# EAGLE design beagletone_jamsession_v0001a (EAGLE 6.4)

## Sheet 1 of 5: BBB Outline
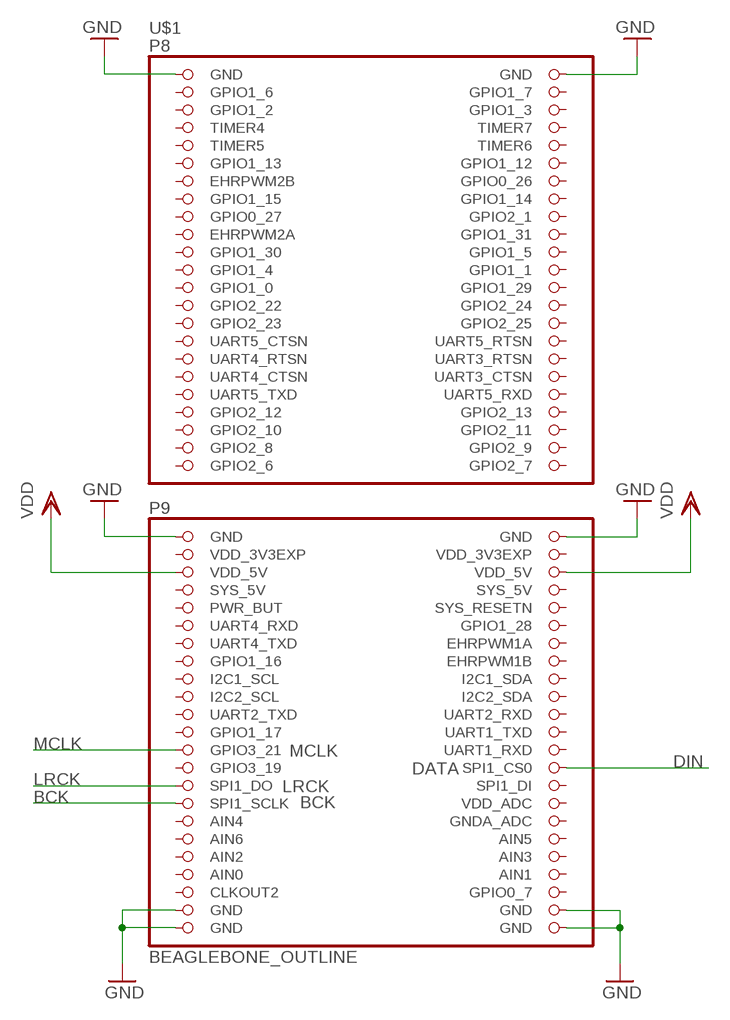
[diagram p0: schematic, sheet 1]

### Parts
U$1  BEAGLEBONE_OUTLINE  [BEAGLEBONE_SHIELD]

### Nets
BCK: U$1.77(SPI1_SCLK) ; also sheet 2
DIN: U$1.74(SPI1_CS0) ; also sheet 2
GND: U$1.1(GND) U$1.2(GND) U$1.47(GND) U$1.48(GND) U$1.89(GND) U$1.90(GND) U$1.91(GND) U$1.92(GND) ; also sheet 2,3,4,5
LRCK: U$1.75(SPI1_DO) ; also sheet 2
MCLK: U$1.71(GPIO3_21)
VDD: U$1.51(VDD_5V) U$1.52(VDD_5V) ; also sheet 2,4,5
Unconnected: U$1.3(GPIO1_6) U$1.4(GPIO1_7) U$1.5(GPIO1_2) U$1.6(GPIO1_3) U$1.7(TIMER4) U$1.8(TIMER7) U$1.9(TIMER5) U$1.10(TIMER6) U$1.11(GPIO1_13) U$1.12(GPIO1_12) U$1.13(EHRPWM2B) U$1.14(GPIO0_26) U$1.15(GPIO1_15) U$1.16(GPIO1_14) U$1.17(GPIO0_27) U$1.18(GPIO2_1) U$1.19(EHRPWM2A) U$1.20(GPIO1_31) U$1.21(GPIO1_30) U$1.22(GPIO1_5) U$1.23(GPIO1_4) U$1.24(GPIO1_1) U$1.25(GPIO1_0) U$1.26(GPIO1_29) U$1.27(GPIO2_22) U$1.28(GPIO2_24) U$1.29(GPIO2_23) U$1.30(GPIO2_25) U$1.31(UART5_CTSN) U$1.32(UART5_RTSN) U$1.33(UART4_RTSN) U$1.34(UART3_RTSN) U$1.35(UART4_CTSN) U$1.36(UART3_CTSN) U$1.37(UART5_TXD) U$1.38(UART5_RXD) U$1.39(GPIO2_12) U$1.40(GPIO2_13) U$1.41(GPIO2_10) U$1.42(GPIO2_11) U$1.43(GPIO2_8) U$1.44(GPIO2_9) U$1.45(GPIO2_6) U$1.46(GPIO2_7) U$1.54(SYS_5V) U$1.55(PWR_BUT) U$1.56(SYS_RESETN) U$1.57(UART4_RXD) U$1.58(GPIO1_28) U$1.59(UART4_TXD) U$1.60(EHRPWM1A) U$1.61(GPIO1_16) U$1.62(EHRPWM1B) U$1.63(I2C1_SCL) U$1.64(I2C1_SDA) U$1.65(I2C2_SCL) U$1.66(I2C2_SDA) U$1.67(UART2_TXD) U$1.68(UART2_RXD) U$1.69(GPIO1_17) U$1.70(UART1_TXD) U$1.72(UART1_RXD) U$1.73(GPIO3_19) U$1.76(SPI1_DI) U$1.78(VDD_ADC) U$1.79(AIN4) U$1.80(GNDA_ADC) U$1.81(AIN6) U$1.82(AIN5) U$1.83(AIN2) U$1.84(AIN3) U$1.86(AIN1) U$1.87(CLKOUT2) U$1.88(GPIO0_7)

### Notes on the sheet
- MCLK
- DATA
- LRCK
- BCK

## Sheet 2 of 5: DAC
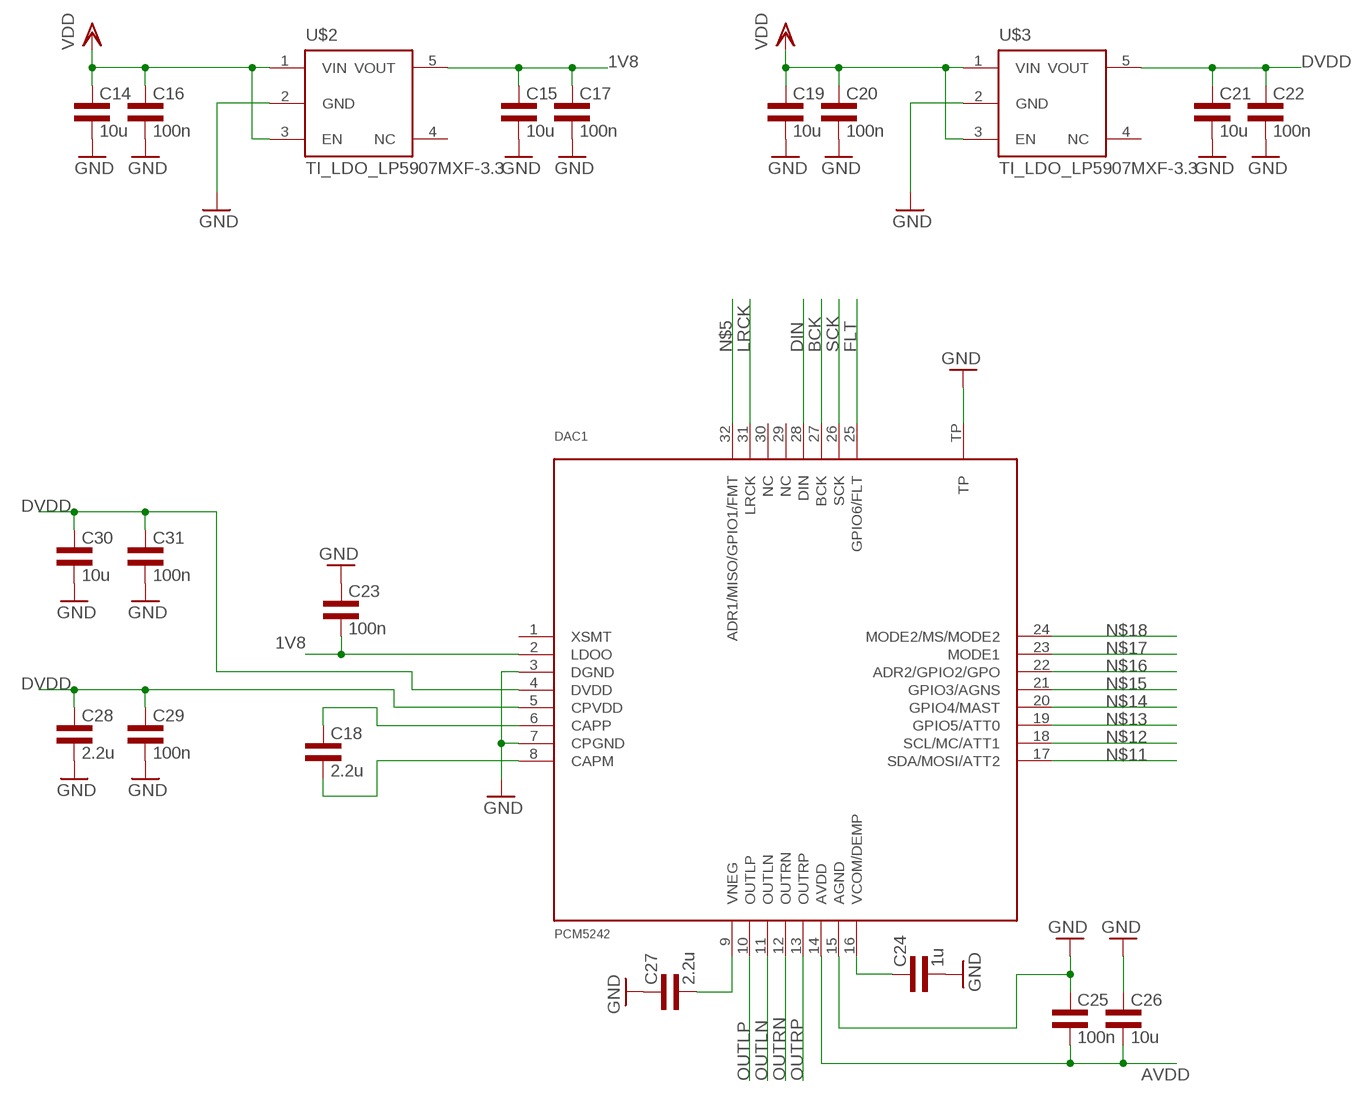
[diagram p1: schematic, sheet 2]

### Parts
C14  10u  CAP0805L3  [0805L3]
C15  10u  CAP0805L3  [0805L3]
C16  100n  CAP0603L3  [0603L3]
C17  100n  CAP0603L3  [0603L3]
C18  2.2u  CAP0805L3  [0805L3]
C19  10u  CAP0805L3  [0805L3]
C20  100n  CAP0603L3  [0603L3]
C21  10u  CAP0805L3  [0805L3]
C22  100n  CAP0603L3  [0603L3]
C23  100n  CAP0402L3  [0402L3]
C24  1u  CAP0603L3  [0603L3]
C25  100n  CAP0402L3  [0402L3]
C26  10u  CAP0603L3  [0603L3]
C27  2.2u  CAP0805L3  [0805L3]
C28  2.2u  CAP0805L3  [0805L3]
C29  100n  CAP0402L3  [0402L3]
C30  10u  CAP0603L3  [0603L3]
C31  100n  CAP0402L3  [0402L3]
DAC1  PCM5242  [S-PVQFN-N32]
U$2  TI_LDO_LP5907MXF-3.3  [TI_LDO_SOT-23]
U$3  TI_LDO_LP5907MXF-3.3  [TI_LDO_SOT-23]

### Nets
1V8: C15.1 C17.P$1 C23.P$2 DAC1.2(LDOO) U$2.5(VOUT)
AVDD: C25.P$2 C26.P$2 DAC1.14(AVDD) ; also sheet 5
BCK: DAC1.27(BCK) ; also sheet 1
DIN: DAC1.28(DIN) ; also sheet 1
DVDD: C21.1 C22.P$1 C28.1 C29.P$1 C30.P$1 C31.P$1 DAC1.4(DVDD) DAC1.5(CPVDD) U$3.5(VOUT)
FLT: DAC1.25(GPIO6/FLT)
GND: C14.2 C15.2 C16.P$2 C17.P$2 C19.2 C20.P$2 C21.2 C22.P$2 C23.P$1 C24.P$2 C25.P$1 C26.P$1 C27.1 C28.2 C29.P$2 C30.P$2 C31.P$2 DAC1.3(DGND) DAC1.7(CPGND) DAC1.15(AGND) DAC1.TP U$2.2(GND) U$3.2(GND) ; also sheet 1,3,4,5
LRCK: DAC1.31(LRCK) ; also sheet 1
N$5: DAC1.32(ADR1/MISO/GPIO1/FMT)
N$11: DAC1.17(SDA/MOSI/ATT2)
N$12: DAC1.18(SCL/MC/ATT1)
N$13: DAC1.19(GPIO5/ATT0)
N$14: DAC1.20(GPIO4/MAST)
N$15: DAC1.21(GPIO3/AGNS)
N$16: DAC1.22(ADR2/GPIO2/GPO)
N$17: DAC1.23(MODE1)
N$18: DAC1.24(MODE2/MS/MODE2)
N$22: C18.1 DAC1.6(CAPP)
N$23: C18.2 DAC1.8(CAPM)
N$26: C24.P$1 DAC1.16(VCOM/DEMP)
N$29: C27.2 DAC1.9(VNEG)
OUTLN: DAC1.11(OUTLN) ; also sheet 3
OUTLP: DAC1.10(OUTLP) ; also sheet 3
OUTRN: DAC1.12(OUTRN) ; also sheet 3
OUTRP: DAC1.13(OUTRP) ; also sheet 3
SCK: DAC1.26(SCK)
VDD: C14.1 C16.P$1 C19.1 C20.P$1 U$2.1(VIN) U$2.3(EN) U$3.1(VIN) U$3.3(EN) ; also sheet 1,4,5
Unconnected: DAC1.1(XSMT) DAC1.29(NC) DAC1.30(NC) U$2.4(NC) U$3.4(NC)

## Sheet 3 of 5: HP OUT
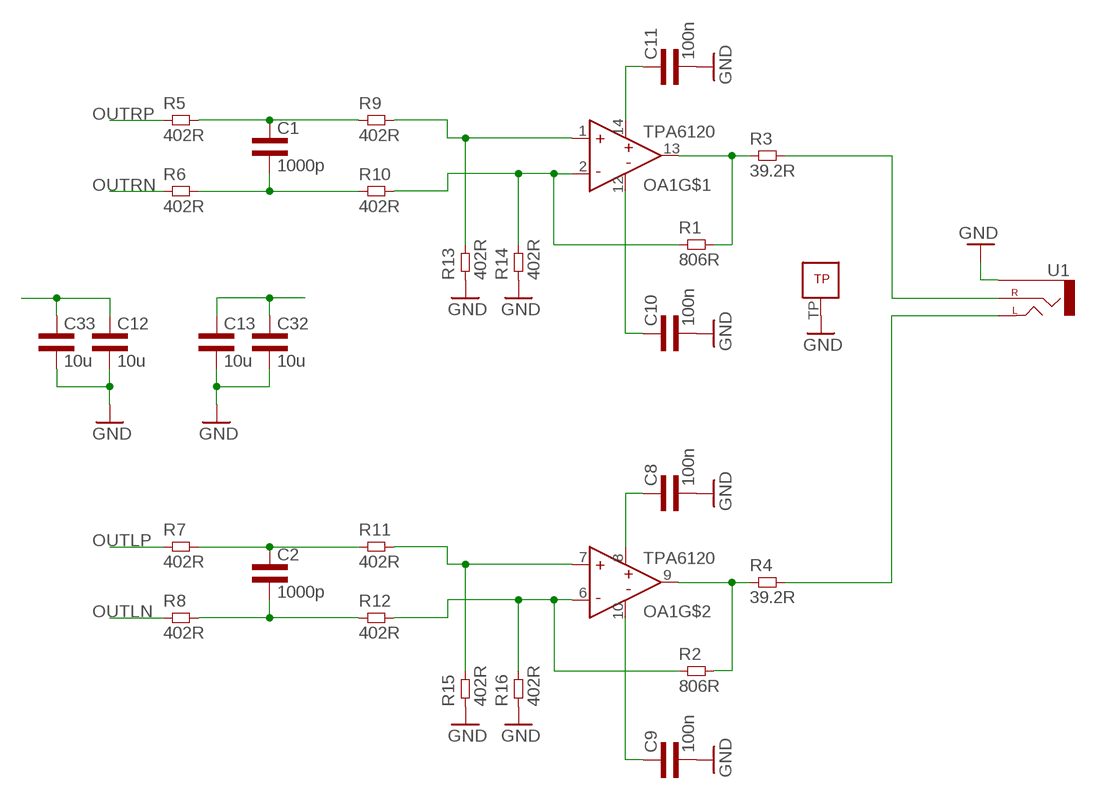
[diagram p2: schematic, sheet 3]

### Parts
C1  1000p  CAP0603L3  [0603L3]
C2  1000p  CAP0603L3  [0603L3]
C8  100n  CAP0603L3  [0603L3]
C9  100n  CAP0603L3  [0603L3]
C10  100n  CAP0603L3  [0603L3]
C11  100n  CAP0603L3  [0603L3]
C12  10u  CAP0603L3  [0603L3]
C13  10u  CAP0603L3  [0603L3]
C32  10u  CAP0603L3  [0603L3]
C33  10u  CAP0603L3  [0603L3]
OA1  TPA6120QFN  [S-PVQFN-N14]
R1  806R  RES0603L3  [0603L3]
R2  806R  RES0603L3  [0603L3]
R3  39.2R  RES0805L3  [0805L3]
R4  39.2R  RES0805L3  [0805L3]
R5  402R  RES0603L3  [0603L3]
R6  402R  RES0603L3  [0603L3]
R7  402R  RES0603L3  [0603L3]
R8  402R  RES0603L3  [0603L3]
R9  402R  RES0603L3  [0603L3]
R10  402R  RES0603L3  [0603L3]
R11  402R  RES0603L3  [0603L3]
R12  402R  RES0603L3  [0603L3]
R13  402R  RES0603L3  [0603L3]
R14  402R  RES0603L3  [0603L3]
R15  402R  RES0603L3  [0603L3]
R16  402R  RES0603L3  [0603L3]
U1  AUDIO-JACKSMD2  [AUDIO-JACK-3.5MM-SMD]

### Nets
GND: C8.P$2 C9.P$2 C10.P$2 C11.P$2 C12.P$2 C13.P$2 C32.P$2 C33.P$2 OA1.TP R13.P$1 R14.P$1 R15.P$1 R16.P$1 U1.SLEEVE ; also sheet 1,2,4,5
N$1: OA1.13(OUT) R1.P$2 R3.1
N$2: OA1.2(IN-) R1.P$1 R10.P$2 R14.P$2
N$3: OA1.9(OUT) R2.P$2 R4.1
N$4: OA1.6(IN-) R2.P$1 R12.P$2 R16.P$2
N$6: OA1.7(IN+) R11.P$2 R15.P$2
N$7: C2.P$2 R8.P$2 R12.P$1
N$8: C2.P$1 R7.P$2 R11.P$1
N$9: OA1.1(IN+) R9.P$2 R13.P$2
N$10: C1.P$1 R5.P$2 R9.P$1
N$19: C1.P$2 R6.P$2 R10.P$1
N$20: R3.2 U1.RING(RIGHT)
N$21: R4.2 U1.TIP(LEFT)
OUTLN: R8.P$1 ; also sheet 2
OUTLP: R7.P$1 ; also sheet 2
OUTRN: R6.P$1 ; also sheet 2
OUTRP: R5.P$1 ; also sheet 2
VCC+: C8.P$1 C11.P$1 C12.P$1 C33.P$1 OA1.8(V+) OA1.14(V+) ; also sheet 4
VCC-: C9.P$1 C10.P$1 C13.P$1 C32.P$1 OA1.10(V-) OA1.12(V-) ; also sheet 4

## Sheet 4 of 5: +5V / -5V
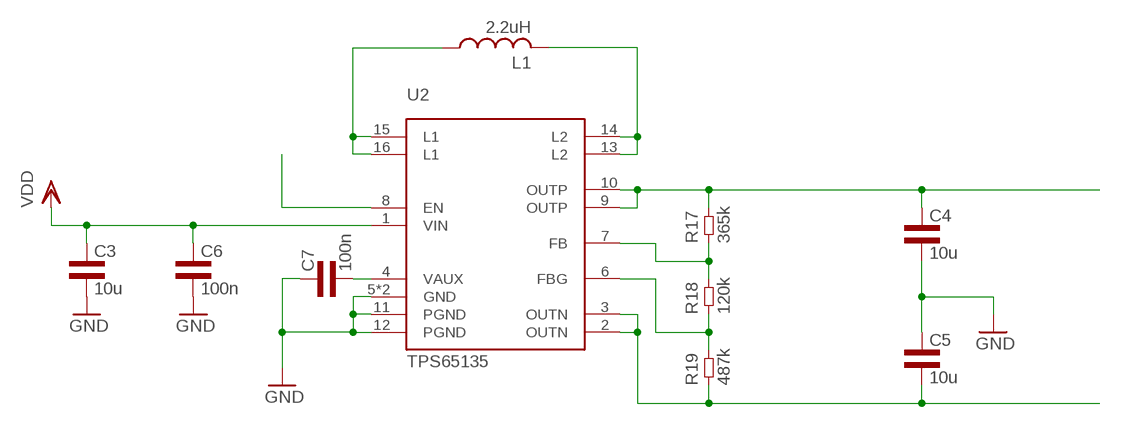
[diagram p3: schematic, sheet 4]

### Parts
C3  10u  CAP0805L3  [0805L3]
C4  10u  CAP0805L3  [0805L3]
C5  10u  CAP0805L3  [0805L3]
C6  100n  CAP0603L3  [0603L3]
C7  100n  CAP0603L3  [0603L3]
L1  2.2uH  L-USL3  [2520]
R17  365k  RES0805L3  [0805L3]
R18  120k  RES0805L3  [0805L3]
R19  487k  RES0805L3  [0805L3]
U2  TPS65135  [S-PWQFN-N16_RTE]

### Nets
EN: U2.8(EN)
FB: R17.1 R18.2 U2.7(FB)
FBG: R18.1 R19.2 U2.6(FBG)
GND: C3.2 C4.2 C5.1 C6.P$2 C7.P$1 U2.5(GND) U2.11(PGND) U2.12(PGND) U2.P$1(GND) ; also sheet 1,2,3,5
L1: L1.1 U2.15(L1) U2.16(L1)
L2: L1.2 U2.13(L2) U2.14(L2)
VAUX: C7.P$2 U2.4(VAUX)
VCC+: C4.1 R17.2 U2.9(OUTP) U2.10(OUTP) ; also sheet 3
VCC-: C5.2 R19.1 U2.2(OUTN) U2.3(OUTN) ; also sheet 3
VDD: C3.1 C6.P$1 U2.1(VIN) ; also sheet 1,2,5

## Sheet 5 of 5: AVDD
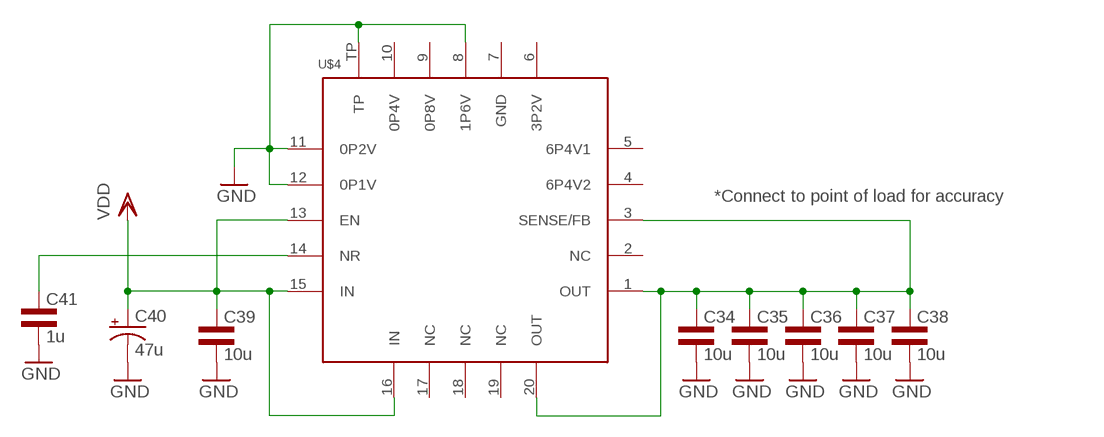
[diagram p4: schematic, sheet 5]

### Parts
C34  10u  CAP0603L3  [0603L3]
C35  10u  CAP0603L3  [0603L3]
C36  10u  CAP0603L3  [0603L3]
C37  10u  CAP0603L3  [0603L3]
C38  10u  CAP0603L3  [0603L3]
C39  10u  CAP0603L3  [0603L3]
C40  47u  CPOL-USCT3216  [CT3216]
C41  1u  CAP0603L3  [0603L3]
U$4  POWER-SUPPLY_POS_V1_TI_LDO_TPS7A4700  [POWER-SUPPLY_POS_V1_TI_LDO_VQFN-20]

### Nets
AVDD: C34.P$1 C35.P$1 C36.P$1 C37.P$1 C38.P$1 U$4.1(OUT) U$4.3(SENSE/FB) U$4.20(OUT) ; also sheet 2
GND: C34.P$2 C35.P$2 C36.P$2 C37.P$2 C38.P$2 C39.P$2 C40.- C41.P$2 U$4.8(1P6V) U$4.11(0P2V) U$4.12(0P1V) U$4.TP ; also sheet 1,2,3,4
N$28: C41.P$1 U$4.14(NR)
VDD: C39.P$1 C40.+ U$4.13(EN) U$4.15(IN) U$4.16(IN) ; also sheet 1,2,4
Unconnected: U$4.2(NC) U$4.4(6P4V2) U$4.5(6P4V1) U$4.6(3P2V) U$4.7(GND) U$4.9(0P8V) U$4.10(0P4V) U$4.17(NC) U$4.18(NC) U$4.19(NC)

### Notes on the sheet
- *Connect to point of load for accuracy

## Power pins joined to a net without a drawn wire
AIN0: U$1.85(AIN0)
SYS_5V: U$1.53(SYS_5V)
VDD_3V3EXP: U$1.49(VDD_3V3EXP) U$1.50(VDD_3V3EXP)

## Library data of the parts
C1-C39 C41 = common:CAP
C40 = rcl:CPOL-US: POLARIZED CAPACITOR, American symbol
DAC1 = common:PCM5242
L1 = rcl:L-US: INDUCTOR, American symbol
OA1 = common:TPA6120
R1-R19 = common:RES
U1 = SparkFun-Connectors:AUDIO-JACK: 3.5mm Audio Jack Simple 3.5mm common PCB mount audio jack. SKU: PRT-08032
U2 = common:TPS65135
U$1 = adafruit:BEAGLEBONE_OUTLINE: Should match A3 pinout - but not completely tested
U$2 U$3 = pcm2707_v1:TI_LDO_LP5907MXF-3.3
U$4 = my_dac_amp:POWER-SUPPLY_POS_V1_TI_LDO_TPS7A4700

## Board
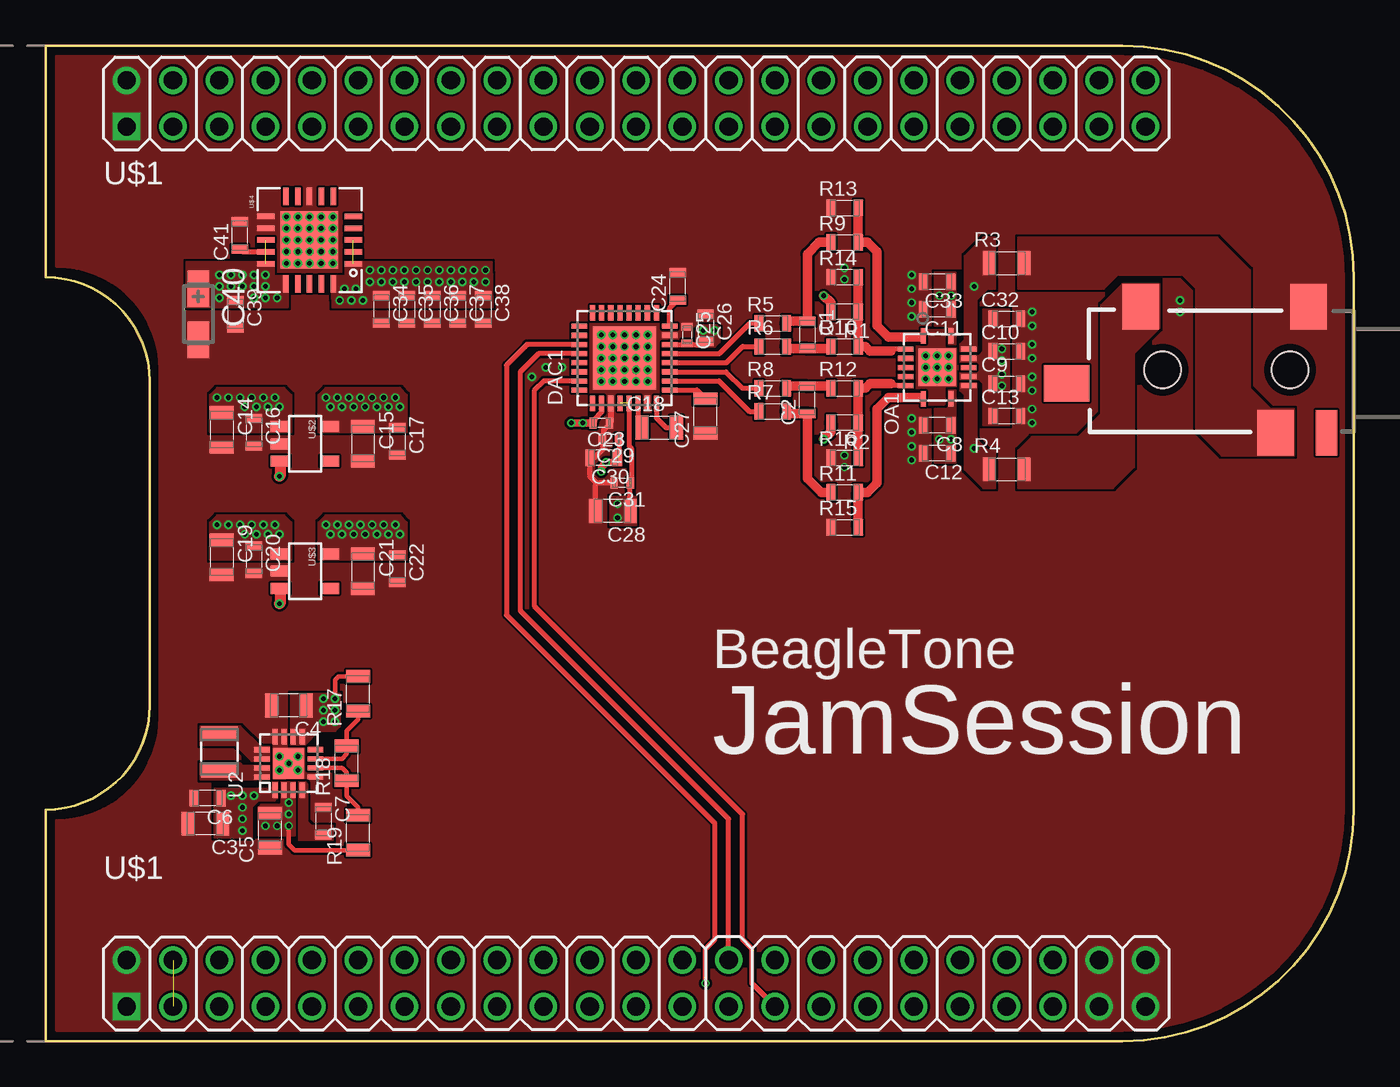
[diagram p5: board, top side]
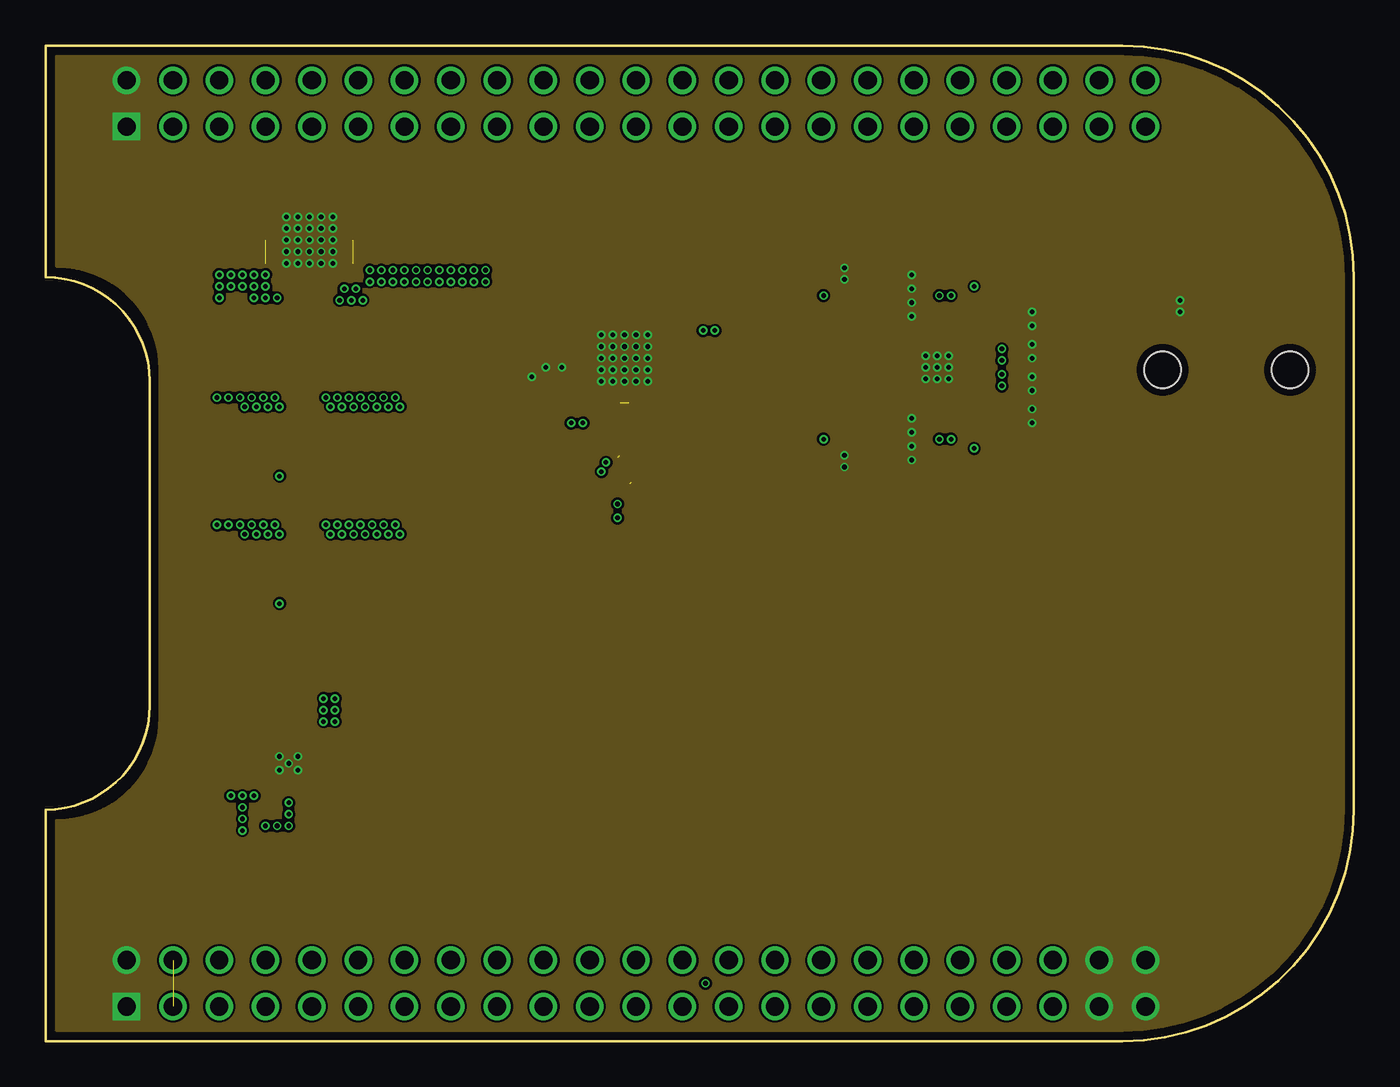
[diagram p6: board, inner layer Route2]
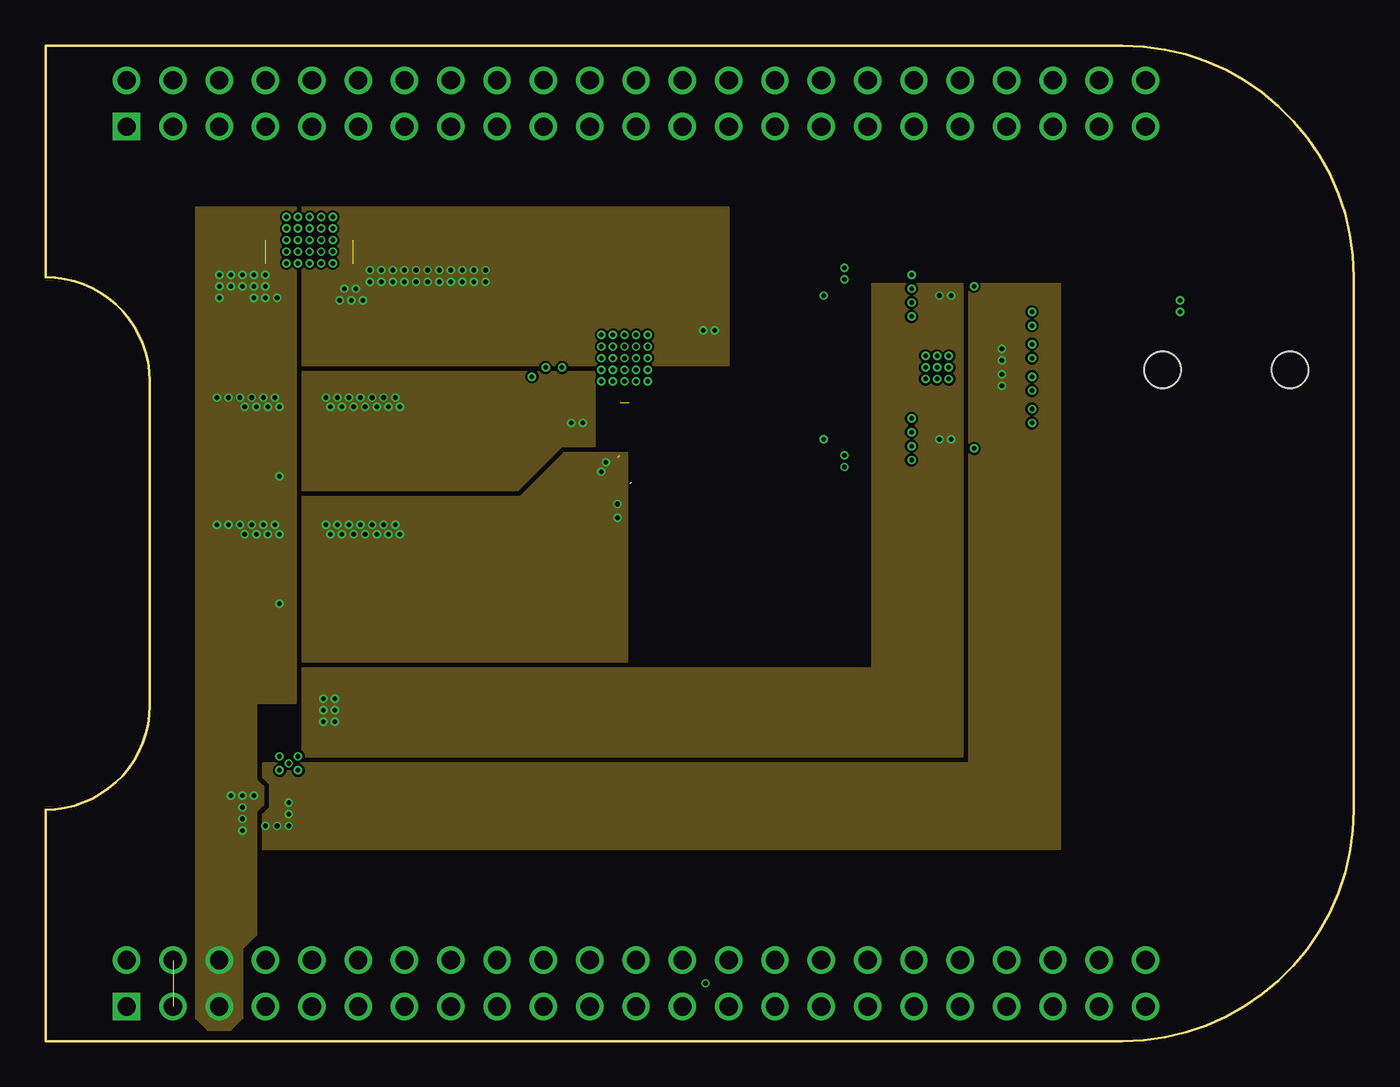
[diagram p7: board, inner layer Route3]
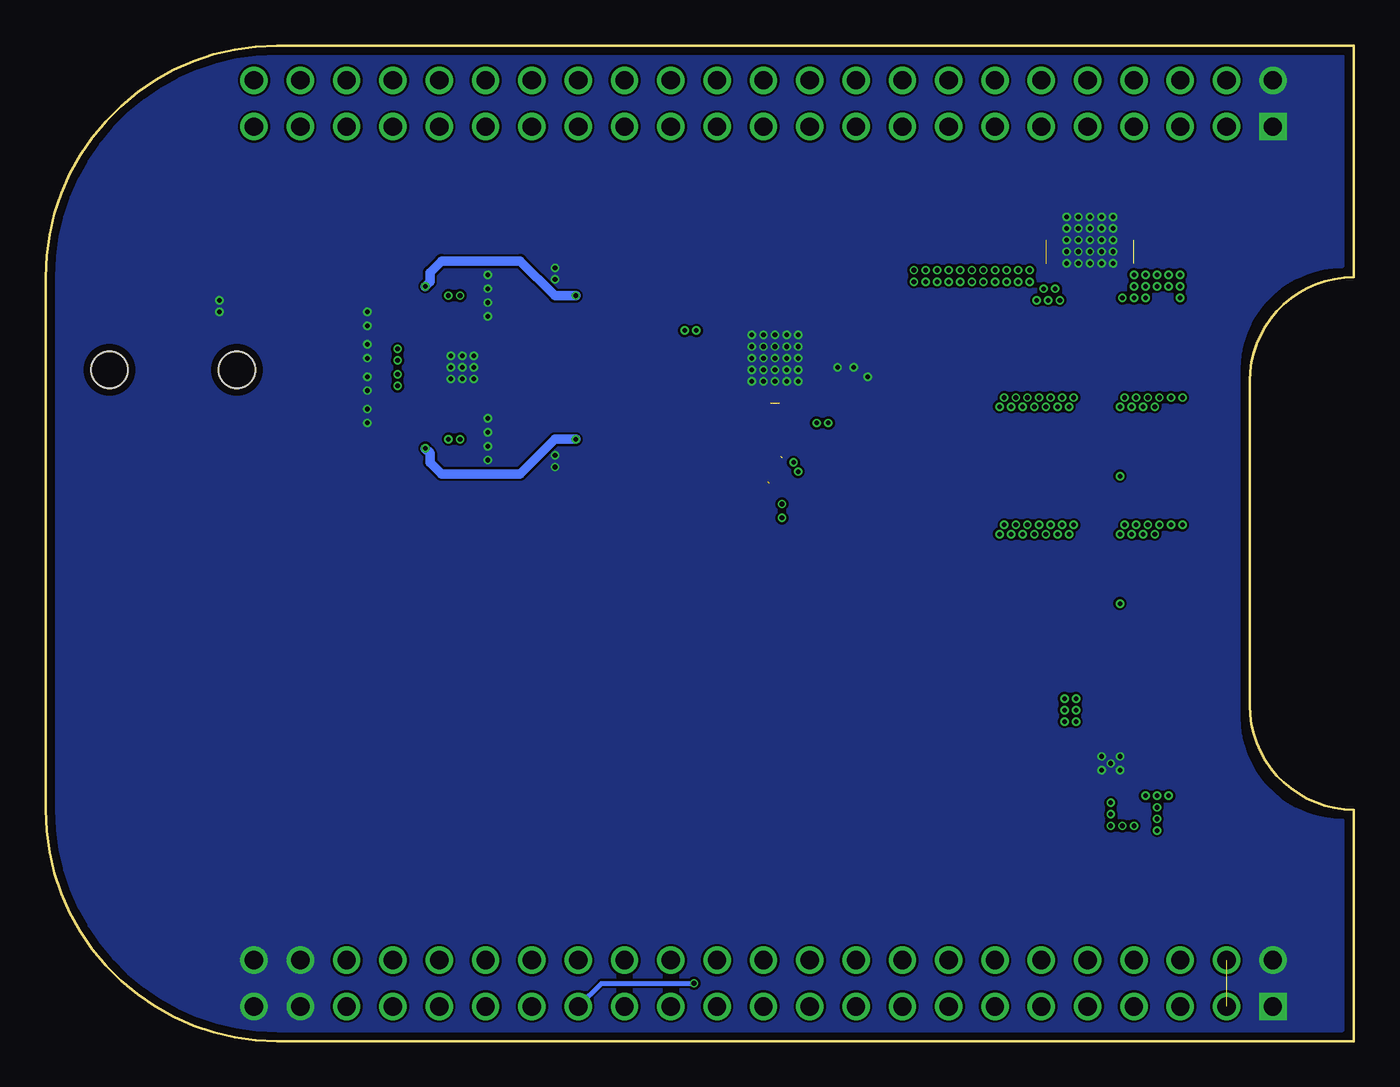
[diagram p8: board, bottom side, seen from below]

Size 71.75 x 54.61 mm. Coordinates in mm from the lower left corner, seen from the top.
Copper layers (1*2*3*16): Top 0.035mm / dielectric 1.5mm / Route2 0.035mm / dielectric 0.15mm / Route3 0.035mm / dielectric 0.2mm / Bottom 0.035mm
Design rules "default *": minimum track width 5mil, minimum drill 10mil, track to track 5mil, track to pad 5mil, pad to pad 5mil, via to via 5mil, smd to smd 5mil, copper to edge 16mil, drill to drill 5mil, minimum pad ring 4mil, minimum via ring 4mil, stop-mask expansion 4mil, vias tented up to drill 16mil, thermal gap 10mil

### Footprints (pad centres in the part's own frame; a part is rotated, then mirrored left to right if it is on the bottom)
0603L3 = smd 0.5 x 0.9: P$1 -0.75,0; P$2 0.75,0
0805L3 = smd 0.7 x 1.3: 1 -0.95,0; 2 0.95,0
0402L3 = smd 0.4 x 0.6: P$1 -0.45,0; P$2 0.45,0
CT3216 = smd 2 x 1.2: + -1.4,0; - 1.4,0
S-PVQFN-N32 = smd 0.85 x 0.28: 1 -2.475,1.75; 2 -2.475,1.25; 3 -2.475,0.75; 4 -2.475,0.25; 5 -2.475,-0.25; 6 -2.475,-0.75; 7 -2.475,-1.25; 8 -2.475,-1.75; 17 2.475,-1.75; 18 2.475,-1.25; 19 2.475,-0.75; 20 2.475,-0.25; 21 2.475,0.25; 22 2.475,0.75; 23 2.475,1.25; 24 2.475,1.75 | smd 0.28 x 0.85: 9 -1.75,-2.475; 10 -1.25,-2.475; 11 -0.75,-2.475; 12 -0.25,-2.475; 13 0.25,-2.475; 14 0.75,-2.475; 15 1.25,-2.475; 16 1.75,-2.475; 25 1.75,2.475; 26 1.25,2.475; 27 0.75,2.475; 28 0.25,2.475; 29 -0.25,2.475; 30 -0.75,2.475; 31 -1.25,2.475; 32 -1.75,2.475 | smd 3.45 x 3.45: TP 0,0
2520 = smd 0.8 x 2: 1 -1,0; 2 1,0
S-PVQFN-N14 = smd 0.85 x 0.28: 1 -1.725,-0.75; 7 1.725,-0.75; 8 1.725,0.75; 14 -1.725,0.75 | smd 0.28 x 0.85: 2 -1,-1.725; 3 -0.5,-1.725; 4 0,-1.725; 5 0.5,-1.725; 6 1,-1.725; 9 1,1.725; 10 0.5,1.725; 11 0,1.725; 12 -0.5,1.725; 13 -1,1.725 | smd 2.05 x 2.05: TP 0,0
AUDIO-JACK-3.5MM-SMD = smd 2 x 2.5: RING 4.3,3.45; SLEEVE 2.5,-3.45; TIP 11.7,-3.45 | smd 1.2 x 2.5: RSH 1.5,3.45 | smd 2.5 x 2: TSH 15.75,0.75 | hole 2: 3.5,0; 10.5,0
S-PWQFN-N16_RTE = smd 0.85 x 0.28: 1 -1.475,0.75; 2 -1.475,0.25; 3 -1.475,-0.25; 4 -1.475,-0.75; 9 1.475,-0.75; 10 1.475,-0.25; 11 1.475,0.25; 12 1.475,0.75 | smd 0.28 x 0.85: 5 -0.75,-1.475; 6 -0.25,-1.475; 7 0.25,-1.475; 8 0.75,-1.475; 13 0.75,1.475; 14 0.25,1.475; 15 -0.25,1.475; 16 -0.75,1.475 | smd 1.7 x 1.7: P$1 0,0
BEAGLEBONE_SHIELD = drill 1 square: 1 4.445,19.05; 47 52.705,19.05 | drill 1: 2 1.905,19.05; 3 4.445,21.59; 4 1.905,21.59; 5 4.445,24.13; 6 1.905,24.13; 7 4.445,26.67; 8 1.905,26.67; 9 4.445,29.21; 10 1.905,29.21; 11 4.445,31.75; 12 1.905,31.75; 13 4.445,34.29; 14 1.905,34.29; 15 4.445,36.83; 16 1.905,36.83; 17 4.445,39.37; 18 1.905,39.37; 19 4.445,41.91; 20 1.905,41.91; 21 4.445,44.45; 22 1.905,44.45; 23 4.445,46.99; 24 1.905,46.99; 25 4.445,49.53; 26 1.905,49.53; 27 4.445,52.07; 28 1.905,52.07; 29 4.445,54.61; 30 1.905,54.61; 31 4.445,57.15; 32 1.905,57.15; 33 4.445,59.69; 34 1.905,59.69; 35 4.445,62.23; 36 1.905,62.23; 37 4.445,64.77; 38 1.905,64.77; 39 4.445,67.31; 40 1.905,67.31; 41 4.445,69.85; 42 1.905,69.85; 43 4.445,72.39; 44 1.905,72.39; 45 4.445,74.93; 46 1.905,74.93; 48 50.165,19.05; 49 52.705,21.59; 50 50.165,21.59; 51 52.705,24.13; 52 50.165,24.13; 53 52.705,26.67; 54 50.165,26.67; 55 52.705,29.21; 56 50.165,29.21; 57 52.705,31.75; 58 50.165,31.75; 59 52.705,34.29; 60 50.165,34.29; 61 52.705,36.83; 62 50.165,36.83; 63 52.705,39.37; 64 50.165,39.37; 65 52.705,41.91; 66 50.165,41.91; 67 52.705,44.45; 68 50.165,44.45; 69 52.705,46.99; 70 50.165,46.99; 71 52.705,49.53; 72 50.165,49.53; 73 52.705,52.07; 74 50.165,52.07; 75 52.705,54.61; 76 50.165,54.61; 77 52.705,57.15; 78 50.165,57.15; 79 52.705,59.69; 80 50.165,59.69; 81 52.705,62.23; 82 50.165,62.23; 83 52.705,64.77; 84 50.165,64.77; 85 52.705,67.31; 86 50.165,67.31; 87 52.705,69.85; 88 50.165,69.85; 89 52.705,72.39; 90 50.165,72.39; 91 52.705,74.93; 92 50.165,74.93
TI_LDO_SOT-23 = smd 0.6 x 1.05: 1 -0.95,-1.35; 2 0,-1.35; 3 0.95,-1.35; 4 0.95,1.35; 5 -0.95,1.35
POWER-SUPPLY_POS_V1_TI_LDO_VQFN-20 = smd 0.3 x 0.95: 1 -1.3,-2.4; 2 -0.65,-2.4; 3 0,-2.4; 4 0.65,-2.4; 5 1.3,-2.4; 11 1.3,2.4; 12 0.65,2.4; 13 0,2.4; 14 -0.65,2.4; 15 -1.3,2.4 | smd 0.95 x 0.3: 6 2.4,-1.3; 7 2.4,-0.65; 8 2.4,0; 9 2.4,0.65; 10 2.4,1.3; 16 -2.4,1.3; 17 -2.4,0.65; 18 -2.4,0; 19 -2.4,-0.65; 20 -2.4,-1.3 | smd 3.15 x 3.15: TP 0,0

### Placement (x,y rotation side)
C1  41.78,38.73 270 top
C2  41.78,35.18 90 top
C3  8.76,11.94 180 top
C4  13.33,18.42 180 top
C5  12.32,11.56 90 top
C6  8.89,13.34 180 top
C7  15.24,12.07 270 top
C8  48.89,33.78 180 top
C9  52.7,36.07 0 top
C10  52.7,37.85 0 top
C11  48.89,40.13 180 top
C12  48.89,32.26 180 top
C13  52.7,34.29 0 top
C14  9.65,33.53 270 top
C15  17.4,32.77 270 top
C16  11.43,33.4 270 top
C17  19.3,32.89 270 top
C18  33.65,33.66 0 top
C19  9.65,26.54 270 top
C20  11.43,26.42 270 top
C21  17.4,25.78 270 top
C22  19.3,25.91 270 top
C23  30.48,33.91 180 top
C24  34.67,41.4 90 top
C25  35.18,38.73 270 top
C26  36.19,39.12 270 top
C27  36.19,34.29 90 top
C28  31.11,29.08 180 top
C29  30.99,33.02 180 top
C30  30.61,32 180 top
C31  31.62,30.61 180 top
C32  52.7,39.62 0 top
C33  48.89,41.66 180 top
C34  18.41,40.13 270 top
C35  19.81,40.13 270 top
C36  21.21,40.13 270 top
C37  22.61,40.13 270 top
C38  24,40.13 270 top
C39  10.41,39.88 270 top
C40  8.38,39.88 270 top
C41  10.67,44.2 90 top
DAC1  31.75,37.47 90 top
L1  9.52,15.88 90 top
OA1  48.89,36.96 270 top
R1  43.81,40.01 180 top
R2  43.81,33.91 180 top
R3  52.7,42.67 0 top
R4  52.7,31.37 0 top
R5  39.88,39.37 0 top
R6  39.88,38.1 0 top
R7  39.88,34.54 0 top
R8  39.88,35.81 0 top
R9  43.81,43.82 0 top
R10  43.81,38.1 0 top
R11  43.81,30.1 0 top
R12  43.81,35.81 0 top
R13  43.81,45.72 0 top
R14  43.81,41.91 0 top
R15  43.81,28.19 0 top
R16  43.81,32 0 top
R17  17.14,19.05 90 top
R18  16.51,15.24 90 top
R19  17.14,11.43 90 top
U1  71.75,36.83 180 top
U2  13.33,15.24 90 top
U$1  -14.61,54.61 270 top
U$2  14.22,32.77 270 top
U$3  14.22,25.78 270 top
U$4  14.48,43.94 90 top

### Tracks (layer width: path | path; a pad name or v marks a point on that pad's centre or on a via)
1V8  (via drill 0.25)
  Top 0.292: DAC1.2 30.5,34.5 30.1,34.1 30.1,33.98 C23.P$2
  Top 0.406: v28.83,33.91 v29.46,33.91 C23.P$2
  other vias: 15.37,35.31 16,35.31 16.64,35.31 17.27,35.31 17.91,35.31 18.54,35.31 19.18,35.31 15.62,34.8 16.26,34.8 16.89,34.8 17.53,34.8 18.16,34.8 18.8,34.8 19.43,34.8
  pour Top (no thermals): 14.99,33.4 19.81,33.4 19.81,35.43 19.43,35.81 15.37,35.81 14.99,35.43
  pour Route3: 14.1,36.7 30.1,36.7 30.1,32.64 28.32,32.64 25.91,30.23 14.1,30.23
AVDD  (via drill 0.25)  (1 unrouted)
  Top 0.279: C25.P$2 35.49,38.22 36.04,38.22 C26.P$2
  Top 0.286: DAC1.14 35.49,38.22
  other vias: 20.95,42.29 20.32,42.29 19.68,42.29 19.05,42.29 18.41,42.29 17.78,42.29 36.07,38.99 36.7,38.99 21.59,42.29 22.22,42.29 22.86,42.29 23.49,42.29 24.13,42.29 17.78,41.66 16.13,40.64 16.76,40.64 17.4,40.64 16.38,41.27 17.02,41.27 18.41,41.66 19.05,41.66 19.68,41.66 20.32,41.66 20.95,41.66 21.59,41.66 22.22,41.66 22.86,41.66 23.49,41.66 24.13,41.66
  pour Top (no thermals): 15.68,41.97 16.45,41.97 16.45,42.74 24.45,42.74 24.51,40.26 15.75,40.26
  pour Top (no thermals): 35.69,38.1 35.69,38.99 35.94,39.24 36.83,39.24 36.96,39.12 36.96,38.35 36.7,38.1
  pour Route3: 14.1,37.08 14.1,45.72 37.46,45.72 37.46,37.08
BCK  (via drill 0.25)
  Top 0.279: 26.4,38.22 25.27,37.08 25.27,23.37 36.7,11.94 36.7,5.59 36.19,5.08 v36.19,3.18
  Top 0.286: DAC1.27 26.4,38.22
  Bottom 0.279: U$1.77 41.27,3.18 v36.19,3.18
DIN
  Top 0.279: U$1.74 37.46,12.19 26.03,23.62 26.03,36.7 27.05,37.72
  Top 0.286: DAC1.28 27.05,37.72
DVDD  (via drill 0.25)  (4 unrouted)
  Top 0.279: 31.1,31.75 C30.P$1 | C29.P$1 31.44,32.09 | 32,32.64 32.13,32.51 32.13,30.66 | C28.1 C31.P$1
  Top 0.286: DAC1.5 32,32.64
  Top 0.406: 31.1,31.75 v30.73,31.75 30.48,31.5 v30.48,31.24
  other vias: 31.37,29.46 31.37,28.7 15.37,28.32 16,28.32 16.64,28.32 17.27,28.32 17.91,28.32 18.54,28.32 19.18,28.32 15.62,27.81 16.26,27.81 16.89,27.81 17.53,27.81 18.16,27.81 18.8,27.81 19.43,27.81
  pour Top (no thermals): 32.38,29.72 32.38,29.84 30.99,29.84 30.99,28.32 32.38,28.32
  pour Top (no thermals): 14.99,26.42 19.81,26.42 19.81,28.45 19.43,28.83 15.37,28.83 14.99,28.45
  pour Route3: 14.1,29.84 26.03,29.84 28.45,32.26 31.88,32.26 31.88,20.83 14.1,20.83
FB
  Top 0.254: U2.7 16.25,15.49 16.51,15.75 R18.2 16.51,17.02 17.14,17.65 R17.1
FBG
  Top 0.254: U2.6 16.25,14.99 16.51,14.73 R18.1 16.51,13.46 17.14,12.83 R19.2
GND  (via drill 0.25)
  Top 0.279: C23.P$1 30.93,33.85 30.61,33.53 30.61,33.09 C29.P$2 30.54,32.44 30.1,32 C30.P$2 29.84,30.99 30.23,30.61 | C31.P$2 30.23,30.61 | C28.2 30.16,30.55 30.23,30.61
  Top 0.292: DAC1.3 31,33.98 C23.P$1
  other vias: 12.83,15.62 13.84,15.62 13.33,15.24 12.83,14.86 13.84,14.86 62.23,40.64 62.23,40.01 30.48,38.73 31.11,38.73 31.75,38.73 32.38,38.73 33.02,38.73 30.48,38.1 30.48,37.47 30.48,36.83 30.48,36.2 31.11,36.2 31.75,36.2 32.38,36.2 33.02,36.2 33.02,36.83 33.02,37.47 33.02,38.1 31.11,38.1 31.75,38.1 32.38,38.1 31.11,37.47 31.11,36.83 31.75,36.83 32.38,36.83 31.75,37.47 32.38,37.47 43.81,42.42 43.81,41.78 43.81,31.5 43.81,32.13 48.26,37.59 48.89,37.59 49.53,37.59 48.26,36.96 48.26,36.32 48.89,36.96 48.89,36.32 49.53,36.96 49.53,36.32 47.5,34.16 47.5,33.4 47.5,32.64 47.5,31.88 47.5,39.75 47.5,40.51 47.5,41.27 47.5,42.04 54.1,33.91 54.1,34.67 54.1,35.69 54.1,36.45 54.1,37.47 54.1,38.23 54.1,39.24 54.1,40.01 13.21,45.21 13.84,45.21 14.48,45.21 15.11,45.21 15.75,45.21 13.21,44.58 13.21,43.94 13.21,43.31 13.21,42.67 13.84,42.67 14.48,42.67 15.11,42.67 15.75,42.67 15.75,43.31 15.75,43.94 15.75,44.58 13.84,44.58 14.48,44.58 15.11,44.58 15.11,43.94 14.48,43.94 13.84,43.94 13.84,43.31 14.48,43.31 15.11,43.31 26.67,36.45 27.43,36.96 28.32,36.96
  pour Top (no thermals): 12.51,14.41 12.51,16.38 12.06,16.38 11.05,17.4 11.05,19.05 13.14,19.05 13.14,14.41
  pour Top (no thermals): 14.41,14.61 14.41,14.41 14.73,14.1 14.73,12.57 15.68,12.57 15.68,13.53 15.49,13.72 15.49,14.61
  pour Bottom (rank 6, no thermals): 0.63,53.98 59.05,53.98 arc-90 71.12,41.91 71.12,12.7 arc-90 59.05,0.64 0.63,0.64 0.63,12.07 arc90 6.35,17.78 6.35,19.05 6.35,36.83 arc90 0.63,42.55
  pour Top (rank 6, no thermals): 0.63,53.98 59.05,53.98 arc-90 71.12,41.91 71.12,12.7 arc-90 59.05,0.64 0.63,0.64 0.63,12.07 arc90 6.35,17.78 6.35,19.05 6.35,36.83 arc90 0.63,42.55
  pour Route2 (no thermals): 0.63,53.98 59.05,53.98 arc-90 71.12,41.91 71.12,12.7 arc-90 59.05,0.64 0.63,0.64 0.63,12.07 arc90 6.35,17.78 6.35,19.05 6.35,36.83 arc90 0.63,42.55
L1
  pour Top (no thermals): 12.26,14.35 12.26,15.11 10.79,15.11 10.67,15.24 8.51,15.24 8.51,14.48 8.51,14.35
L2
  pour Top (no thermals): 12.26,15.37 12.26,16.13 11.81,16.13 10.67,17.27 8.51,17.27 8.51,16.26 10.41,16.26 11.3,15.37
LRCK
  Top 0.279: U$1.75 38.73,3.18 38.73,5.08 38.23,5.59 38.23,12.45 26.8,23.88 26.8,35.69 27.32,36.22
  Top 0.286: DAC1.31 27.32,36.22
N$1  (via drill 0.25)
  Top 0.508: R1.P$2 43.06,40.5 v42.67,40.89
  Bottom 0.508: v50.93,41.4 50.67,41.66 50.67,42.16 50.04,42.8 45.72,42.8 43.81,40.89 v42.67,40.89
  pour Top (no thermals): 50.16,37.85 50.16,38.23 50.42,38.48 50.42,43.05 51.43,44.07 52.07,44.07 52.07,41.27 51.69,41.27 51.05,40.64 51.05,37.85
N$2
  Top 0.286: OA1.2 46.34,37.96 46.48,37.85 46.35,37.85
  Top 0.508: R14.P$2 R1.P$1 R10.P$2 44.96,38.1 45.21,37.85 46.35,37.85
N$3  (via drill 0.25)
  Top 0.508: R2.P$2 43.06,33.41 v42.67,33.02
  Bottom 0.508: v42.67,33.02 43.81,33.02 45.72,31.12 50.04,31.12 50.67,31.75 50.67,32.26 v50.93,32.51
  pour Top (no thermals): 50.16,36.07 50.16,35.69 50.42,35.43 50.42,31.37 51.43,30.35 52.07,30.35 52.07,32.39 51.69,32.39 51.05,33.02 51.05,36.07
N$4
  Top 0.286: OA1.6 46.34,35.96 46.48,36.07 46.35,36.07
  Top 0.508: R16.P$2 R2.P$1 R12.P$2 44.96,35.81 45.21,36.07 46.35,36.07
N$6
  Top 0.254: 44.45,29.84 R11.P$2
  Top 0.279: OA1.7 48.08,35.23 48.01,35.31
  Top 0.508: R15.P$2 R11.P$2 45.08,30.1 45.59,30.61 45.59,34.67 46.23,35.31 48.01,35.31
N$7
  Top 0.508: R8.P$2 40.74,35.93 C2.P$2 42.95,35.93 R12.P$1
N$8
  Top 0.508: R11.P$1 42.54,30.1 41.78,30.86 C2.P$1 40.74,34.43 R7.P$2
N$9
  Top 0.279: OA1.1 48.08,38.68 48.01,38.61
  Top 0.508: R13.P$2 R9.P$2 45.08,43.82 45.59,43.31 45.59,39.24 46.23,38.61 48.01,38.61
N$10
  Top 0.508: R9.P$1 42.42,43.82 41.78,43.18 C1.P$1 40.74,39.48 R5.P$2
N$19
  Top 0.508: R6.P$2 40.74,37.98 C1.P$2 42.95,37.98 R10.P$1
N$20
  pour Top (no thermals): 53.34,44.07 64.26,44.07 66.04,42.29 66.04,35.81 67.18,34.67 68.45,34.67 68.45,32.13 64.52,32.13 63.12,33.53 63.12,41.27 62.36,42.04 58.8,42.04 58.04,41.27 53.34,41.27
N$21
  pour Top (no thermals): 54.1,33.15 56.64,33.15 57.91,34.42 57.91,40.39 59.05,41.53 61.09,41.53 61.09,39.12 59.69,37.72 59.69,31.5 58.55,30.35 53.34,30.35 53.34,32.39
N$22
  Top 0.279: 32.5,33.86 C18.1
  Top 0.286: DAC1.6 32.5,33.86
N$23
  Top 0.279: 33.5,34.19 34.04,33.66 C18.2
  Top 0.286: DAC1.8 33.5,34.19
N$26
  Top 0.279: DAC1.16 34.22,40.21 C24.P$1
N$28
  Top 0.279: U$4.14 10.82,43.29 C41.P$1
N$29
  Top 0.279: 35.72,35.72 C27.2
  Top 0.286: DAC1.9 35.72,35.72
OUTLN
  Top 0.279: 37.33,36.72 38.23,35.81 R8.P$1
  Top 0.286: DAC1.11 37.33,36.72
OUTLP
  Top 0.279: 36.94,36.22 38.61,34.54 R7.P$1
  Top 0.286: DAC1.10 36.94,36.22
OUTRN
  Top 0.279: 37.34,37.22 38.23,38.1 R6.P$1
  Top 0.286: DAC1.12 37.34,37.22
OUTRP
  Top 0.279: R5.P$1 38.61,39.37 36.95,37.72
  Top 0.286: DAC1.13 36.95,37.72
VAUX
  pour Top (no thermals): 13.91,14.22 14.22,14.22 14.35,14.1 14.35,12.07 14.6,11.81 15.62,11.81 15.75,11.81 15.75,11.05 13.91,11.05
VCC+  (via drill 0.25)
  Top 0.254: R17.2 16.06,20 15.87,19.81 v15.87,18.8
  other vias: 15.24,18.8 15.24,18.16 15.87,18.16 15.24,17.53 15.87,17.53 49.02,40.89 49.02,33.02 49.66,40.89 49.66,33.02
  pour Top (no thermals): 13.46,16.26 13.46,19.05 16.13,19.05 16.13,17.27 15.87,17.02 14.99,17.02 14.22,16.26
  pour Top (no thermals): 49.53,38.23 49.53,39.12 49.4,39.24 48.77,39.24 48.77,42.16 49.91,42.16 49.91,38.23
  pour Top (no thermals): 49.53,35.69 49.53,34.8 49.4,34.67 48.77,34.67 48.77,31.75 49.91,31.75 49.91,35.69
  pour Route3: 14.1,20.45 45.34,20.45 45.34,41.53 50.29,41.53 50.29,15.62 14.1,15.62
VCC-  (via drill 0.25)
  Top 0.254: R19.1 13.65,10.48 13.33,10.8 v13.33,11.81
  other vias: 12.06,11.81 12.7,11.81 13.33,12.45 13.33,13.08 52.45,37.97 52.45,37.34 52.45,36.58 52.45,35.94
  pour Top (no thermals): 12.95,14.22 12.95,13.08 12.83,12.95 11.81,12.95 11.68,12.83 11.68,11.3 13.65,11.3 13.65,14.22
  pour Top (no thermals): 50.16,37.59 51.18,37.59 51.43,37.85 51.43,40.13 52.83,40.13 52.83,33.78 51.43,33.78 51.43,36.07 51.18,36.32 50.16,36.32
  pour Route3: 11.94,15.24 50.67,15.24 50.67,41.53 55.63,41.53 55.63,10.54 11.94,10.54 11.94,12.45 12.32,12.83 12.32,14.1 11.94,14.48
VDD  (via drill 0.25)  (1 unrouted)
  Top 0.61: U$3.3 12.87,24.05 v12.83,24 | U$2.3 12.87,31.04 v12.83,30.99
  other vias: 10.79,12.83 10.79,11.56 11.43,13.46 10.79,13.46 10.79,12.19 10.16,13.46 9.4,28.32 10.03,28.32 10.67,28.32 11.3,28.32 11.94,28.32 12.57,28.32 9.4,35.31 10.03,35.31 10.67,35.31 11.3,35.31 11.94,35.31 12.57,35.31 12.06,40.77 11.43,40.77 12.06,41.4 11.43,41.4 12.06,42.04 11.43,42.04 10.79,42.04 10.16,42.04 9.52,42.04 12.7,40.77 9.52,40.77 10.79,41.4 10.16,41.4 9.52,41.4 10.92,34.8 11.56,34.8 12.19,34.8 12.83,34.8 10.92,27.81 11.56,27.81 12.19,27.81 12.83,27.81
  pour Top (no thermals): 9.27,11.18 9.27,13.84 12.32,13.84 12.45,13.97 12.45,14.22 12.7,14.22 12.7,13.34 12.57,13.21 11.68,13.21 11.3,12.83 11.3,11.18
  pour Route3 (no thermals): 8.89,0.64 8.25,1.27 8.25,45.72 13.72,45.72 13.72,18.54 11.56,18.54 11.56,14.35 11.94,13.97 11.94,12.95 11.56,12.57 11.56,5.84 10.79,5.08 10.79,1.27 10.16,0.64
  pour Top (no thermals): 13.46,26.42 13.46,28.45 13.08,28.83 9.4,28.83 9.02,28.45 9.02,26.42
  pour Top (no thermals): 13.46,33.4 13.46,35.43 13.08,35.81 9.4,35.81 9.02,35.43 9.02,33.4
  pour Top (no thermals): 12.51,42.74 7.75,42.74 7.75,40.26 13.27,40.26 13.27,41.97 12.51,41.97
VDD_3V3EXP  (1 unrouted)

### Text on the board
tPlace: BeagleTone | JamSession